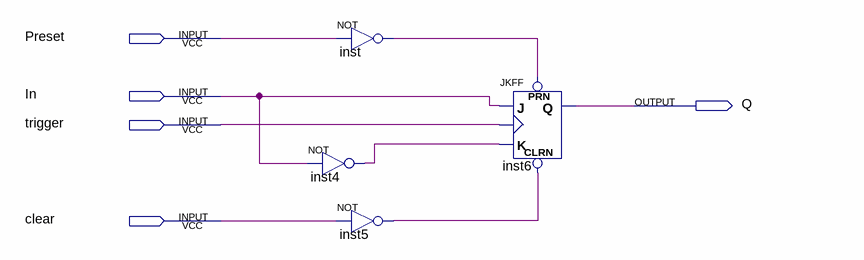
[diagram p0: schematic sheet]
// Quartus schematic flipflop-jk.bdf as structural Verilog: 4 symbols, 5 pins
module \flipflop-jk  (
  input  Preset,
  input  In,
  input  trigger,
  input  clear,
  output Q
);

  wire inst4_out, inst5_out, inst_out;

  not inst4 (inst4_out, In);
  not inst (inst_out, Preset);
  not inst5 (inst5_out, clear);
  JKFF inst6 (.PRN(inst_out), .CLRN(inst5_out), .K(inst4_out), .J(In), .CLK(trigger), .Q(Q));
endmodule
